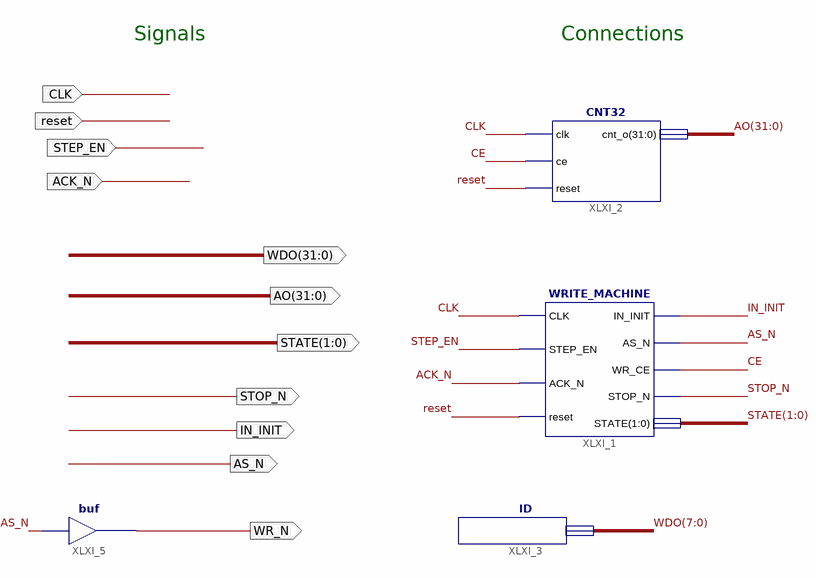
[diagram p0: schematic sheet 1]
// Xilinx ISE schematic WRITEM.sch (spartan6) as structural Verilog: 4 symbols, 11 ports
module WRITEM (
  input  CLK,
  input  STEP_EN,
  input  ACK_N,
  input  reset,
  output AS_N,
  output IN_INIT,
  output STOP_N,
  output [1:0] STATE,
  output [31:0] AO,
  output [31:0] WDO,
  output WR_N
);

  wire CE;

  buf XLXI_5 (WR_N, AS_N);
  WRITE_MACHINE XLXI_1 (
    .CLK(CLK), .STEP_EN(STEP_EN), .ACK_N(ACK_N), .reset(reset), .IN_INIT(IN_INIT), .AS_N(AS_N), .WR_CE(CE),
    .STOP_N(STOP_N), .STATE(STATE));
  CNT32 XLXI_2 (.clk(CLK), .ce(CE), .reset(reset), .cnt_o(AO));
  ID XLXI_3 (.IDOUT(WDO[7:0]));

  // Notes on the sheet:
  //   Signals
  //   Connections
endmodule
